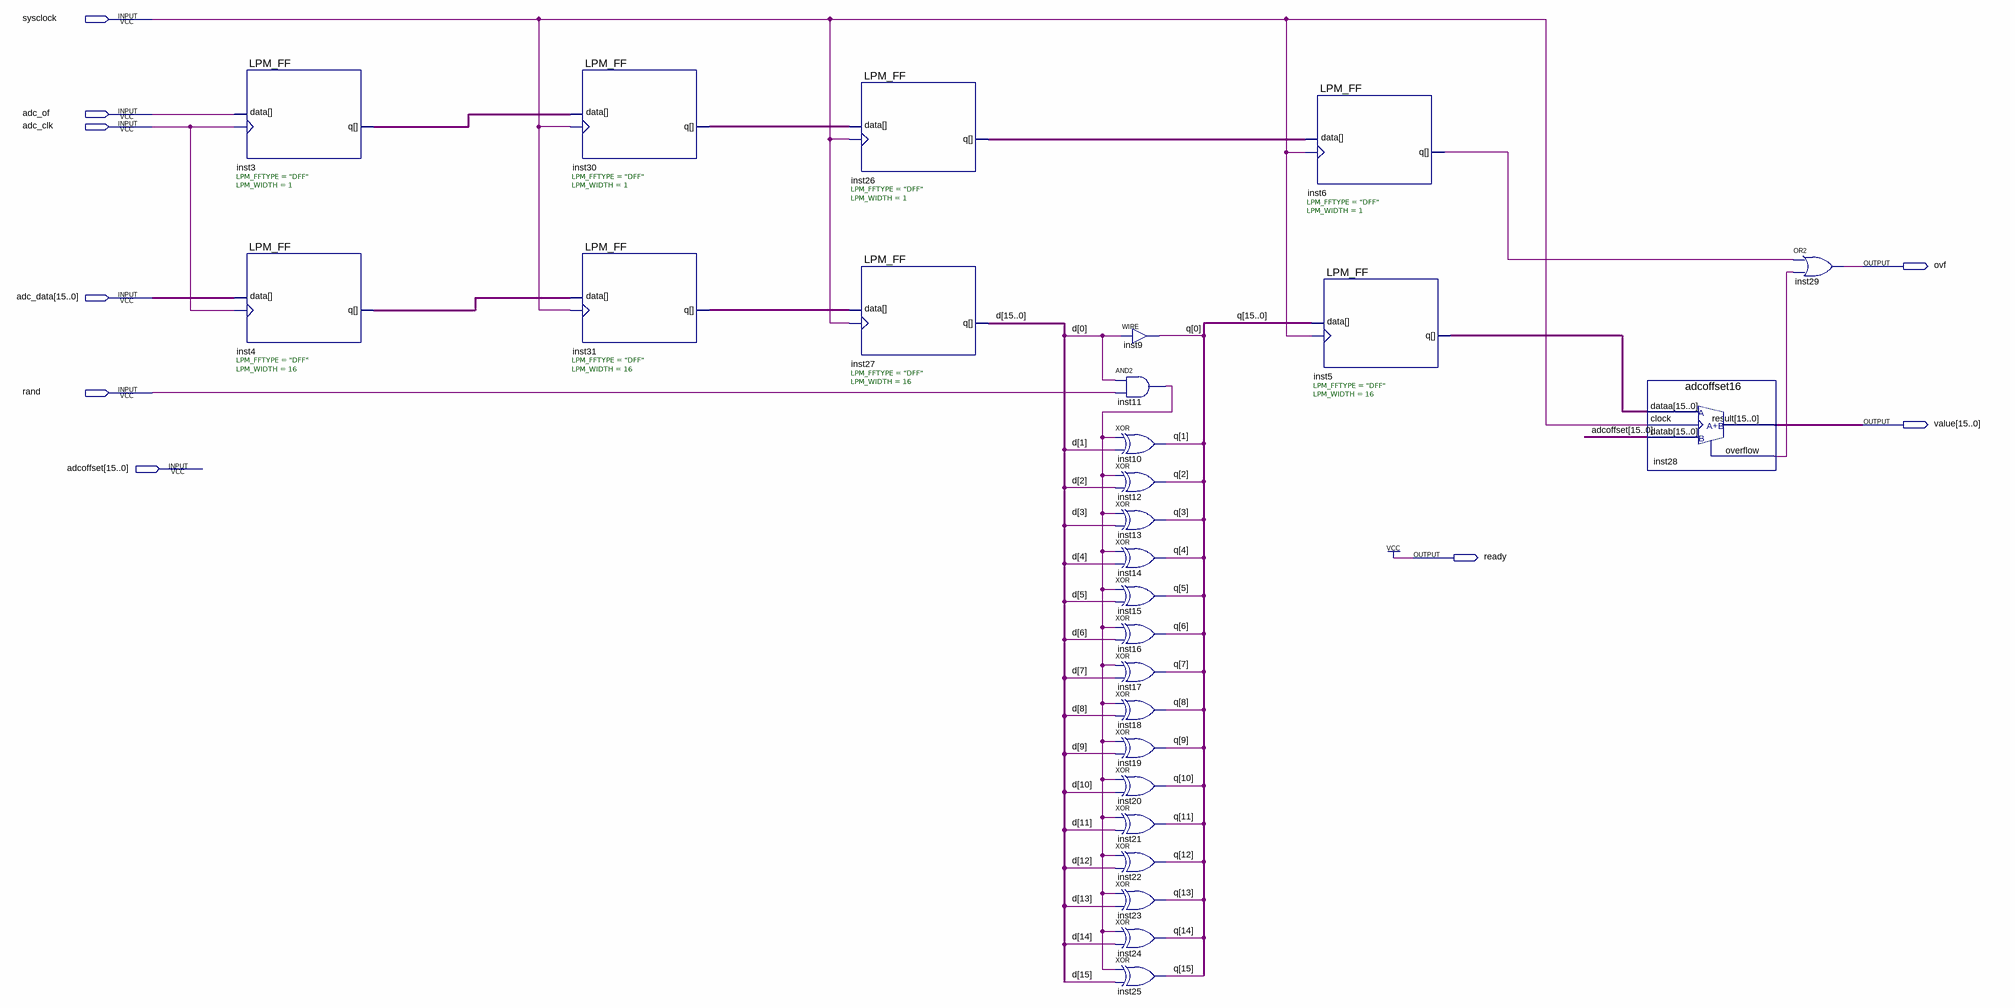
[diagram p0: schematic sheet]
// Quartus schematic LTC2208_input.bdf as structural Verilog: 27 symbols, 9 pins
module LTC2208_input (
  input  sysclock,
  input  adc_of,
  input  adc_clk,
  input  [15:0] adc_data,
  input  \rand ,
  input  [15:0] adcoffset,
  output ovf,
  output [15:0] value,
  output ready
);

  wire inst3_q, inst6_q, inst11_out, inst26_q, inst28_overflow, inst30_q;
  wire [15:0] d, inst4_q, inst5_q, inst31_q, q;

  LPM_FF #(.LPM_FFTYPE("DFF"), .LPM_WIDTH(1)) inst3 (.clock(adc_clk), .data(adc_of), .q(inst3_q));
  LPM_FF #(.LPM_FFTYPE("DFF"), .LPM_WIDTH(16)) inst4 (.clock(adc_clk), .data(adc_data), .q(inst4_q));
  LPM_FF #(.LPM_FFTYPE("DFF"), .LPM_WIDTH(1)) inst30 (.clock(sysclock), .data(inst3_q), .q(inst30_q));
  LPM_FF #(.LPM_FFTYPE("DFF"), .LPM_WIDTH(16)) inst31 (.clock(sysclock), .data(inst4_q), .q(inst31_q));
  LPM_FF #(.LPM_FFTYPE("DFF"), .LPM_WIDTH(1)) inst26 (.clock(sysclock), .data(inst30_q), .q(inst26_q));
  LPM_FF #(.LPM_FFTYPE("DFF"), .LPM_WIDTH(16)) inst27 (.clock(sysclock), .data(inst31_q), .q(d));
  assign q[0] = d[0];  // WIRE inst9
  and inst11 (inst11_out, d[0], \rand );
  xor inst10 (q[1], inst11_out, d[1]);
  xor inst12 (q[2], inst11_out, d[2]);
  xor inst13 (q[3], inst11_out, d[3]);
  xor inst14 (q[4], inst11_out, d[4]);
  xor inst15 (q[5], inst11_out, d[5]);
  xor inst16 (q[6], inst11_out, d[6]);
  xor inst17 (q[7], inst11_out, d[7]);
  xor inst18 (q[8], inst11_out, d[8]);
  xor inst19 (q[9], inst11_out, d[9]);
  xor inst20 (q[10], inst11_out, d[10]);
  xor inst21 (q[11], inst11_out, d[11]);
  xor inst22 (q[12], inst11_out, d[12]);
  xor inst23 (q[13], inst11_out, d[13]);
  xor inst24 (q[14], inst11_out, d[14]);
  xor inst25 (q[15], inst11_out, d[15]);
  LPM_FF #(.LPM_FFTYPE("DFF"), .LPM_WIDTH(1)) inst6 (.clock(sysclock), .data(inst26_q), .q(inst6_q));
  LPM_FF #(.LPM_FFTYPE("DFF"), .LPM_WIDTH(16)) inst5 (.clock(sysclock), .data(q), .q(inst5_q));
  adcoffset16 inst28 (.dataa(inst5_q), .datab(adcoffset), .clock(sysclock), .result(value), .overflow(inst28_overflow));
  or inst29 (ovf, inst6_q, inst28_overflow);

  assign ready = 1'b1;
endmodule
